# EAGLE design clock-delay (EAGLE 7.6.0)
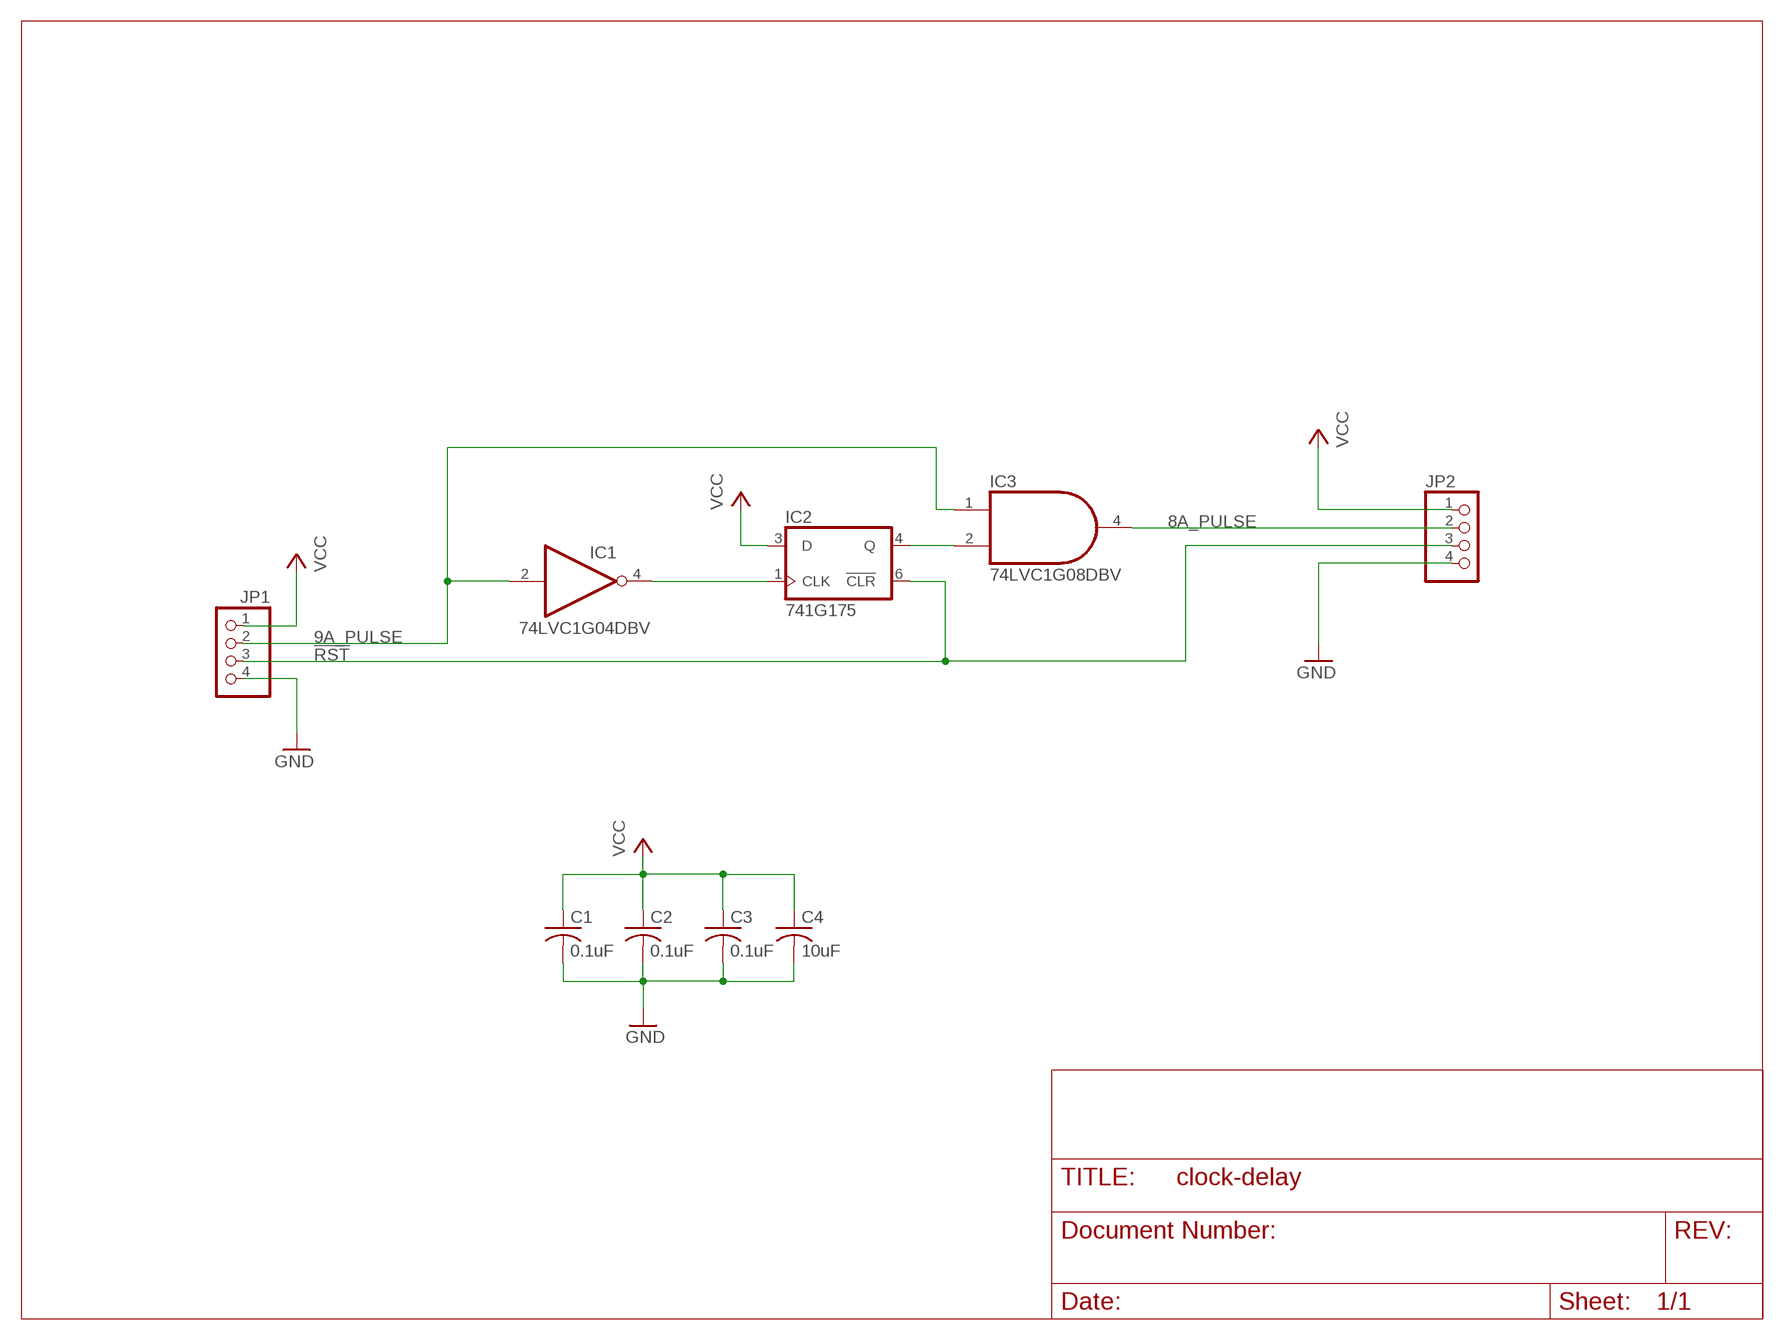
[diagram p0: schematic, sheet 1]

## Parts
C1  0.1uF  C-USC0805  [C0805]
C2  0.1uF  C-USC0805  [C0805]
C3  0.1uF  C-USC0805  [C0805]
C4  10uF  C-USC0805  [C0805]
IC1  74LVC1G04DBV  [SOT23-5]
IC2  741G175  [DBV_R-PDSO-G6]
IC3  74LVC1G08DBV  [SOT23-5]
JP1  PINHD-1X4  [1X04]
JP2  PINHD-1X4  [1X04]

## Nets
8A_PULSE: IC3.4(O) JP2.2
9A_PULSE: IC1.2(I) IC3.1(I0) JP1.2
!RST: IC2.6(!CLR) JP1.3 JP2.3
GND: C1.2 C2.2 C3.2 C4.2 JP1.4 JP2.4
N$12: IC2.4(Q) IC3.2(I1)
N$23: IC1.4(O) IC2.1(CLK)
VCC: C1.1 C2.1 C3.1 C4.1 IC2.3(D) JP1.1 JP2.1

## Power pins joined to a net without a drawn wire
GND: IC1.3(GND) IC2.2(GND) IC3.3(GND)
VCC: IC1.5(VCC) IC2.5(VCC) IC3.5(VCC)

## Library data of the parts
C1-C4 = resistor:C-US: CAPACITOR, American symbol
IC1 = 74xx-little-us:74*1G04: INVERTER Gate
IC2 = witch-e:74*1G175
IC3 = 74xx-little-us:74*1G08: 2-input AND gate
JP1 JP2 = pinhead:PINHD-1X4: PIN HEADER

## Board
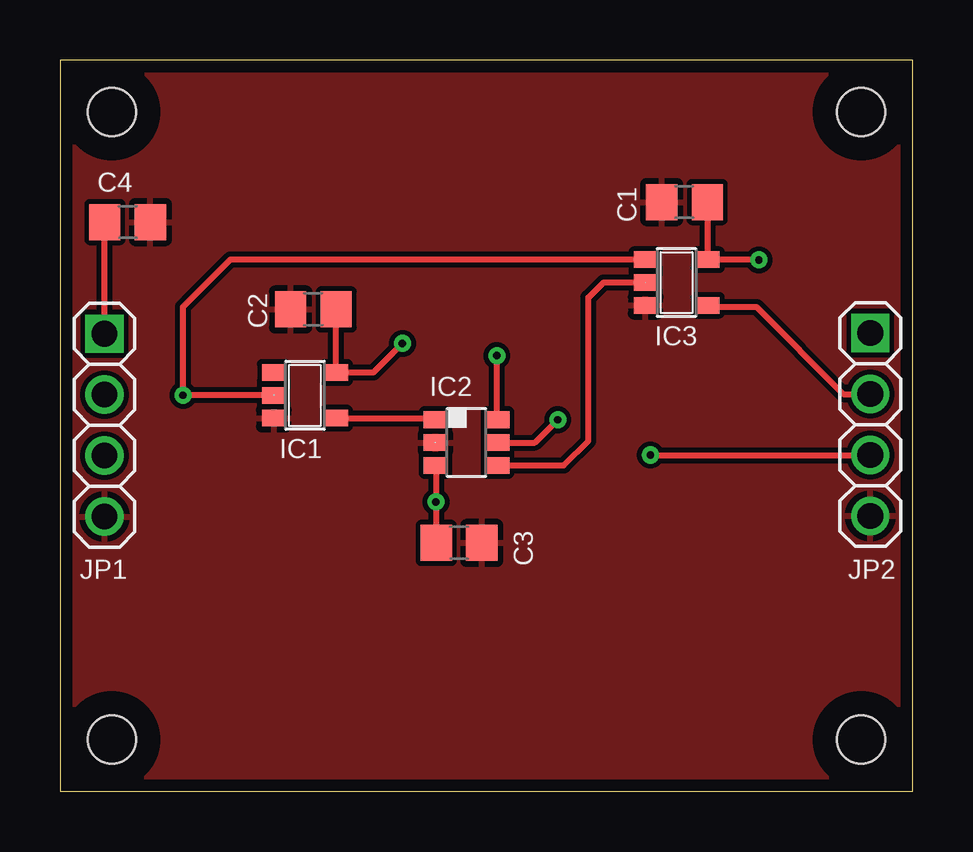
[diagram p1: board, top side]
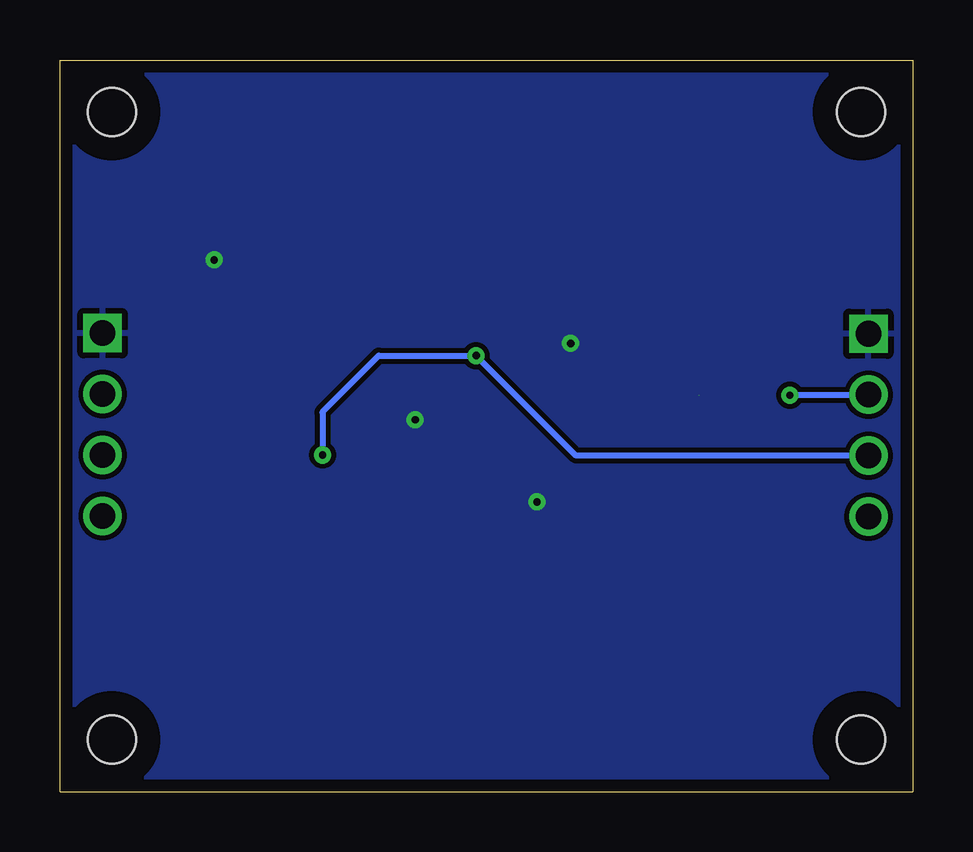
[diagram p2: board, bottom side, seen from below]

Size 35.56 x 30.48 mm. Coordinates in mm from the lower left corner, seen from the top.
Outline: 35.56,30.48 0,30.48 0,0 35.56,0 35.56,30.48
Copper layers (1*16): Top 0.035mm / dielectric 1.5mm / Bottom 0.035mm
Design rules "default *": minimum track width 8mil, minimum drill 12mil, track to track 8mil, track to pad 8mil, pad to pad 8mil, via to via 8mil, smd to smd 8mil, copper to edge 20mil, drill to drill 8mil, minimum pad ring 10mil, minimum via ring 8mil, stop-mask expansion 4mil, vias tented up to drill 0mil, thermal gap 10mil
Holes 2.01 mm at 2.16,2.16 33.4,2.16 33.4,28.32 2.16,28.32
tRestrict: area 31.4,0.2 to 35.4,4.2; area 31.4,26.3 to 35.4,30.3; area 0.2,26.3 to 4.2,30.3; area 0.2,0.2 to 4.2,4.2
bRestrict: area 31.4,0.2 to 35.4,4.2; area 31.4,26.3 to 35.4,30.3; area 0.2,26.3 to 4.2,30.3; area 0.2,0.2 to 4.2,4.2

### Footprints (pad centres in the part's own frame; a part is rotated, then mirrored left to right if it is on the bottom)
C0805 = smd 1.3 x 1.5: 1 -0.95,0; 2 0.95,0
SOT23-5 = smd 0.69 x 0.99: 1 -0.95,-1.29; 2 0,-1.29; 3 0.95,-1.29; 4 0.95,1.3; 5 -0.95,1.3
DBV_R-PDSO-G6 = smd 0.69 x 0.99: 1 -0.95,-1.29; 2 0,-1.29; 3 0.95,-1.29; 4 0.95,1.3; 5 0,1.3; 6 -0.95,1.3
1X04 = drill 1.067 square: 1 -3.81,0 | drill 1.067: 2 -1.27,0; 3 1.27,0; 4 3.81,0

### Placement (x,y rotation side)
C1  26.04,24.56 180 top
C2  10.57,20.09 180 top
C3  16.64,10.36 0 top
C4  2.82,23.72 0 top
IC1  10.21,16.51 270 top
IC2  16.94,14.54 270 top
IC3  25.7,21.21 270 top
JP1  1.85,15.27 270 top
JP2  33.78,15.29 270 top

### Tracks (layer width: path | path; a pad name or v marks a point on that pad's centre or on a via)
8A_PULSE
  Top 0.254: IC3.4 27.07,20.19 29.03,20.19 32.66,16.56 JP2.2
9A_PULSE  (via drill 0.3)  (1 unrouted)
  Top 0.254: 24.43,22.18 IC3.1 7.1,22.16 5.13,20.19 v5.13,16.51 IC1.2
  Bottom 0.254: v5.13,16.51 5.11,16.54 JP1.2
!RST  (via drill 0.3)
  Top 0.254: IC2.6 18.21,15.52 v18.21,18.16 | v24.61,14.02 JP2.3
  Bottom 0.254: JP1.3 14.05,13.99 v18.21,18.16 22.28,18.16 24.59,15.85 arc-45 24.61,15.79 v24.61,14.02
GND
  pour Top: 0,0 35.56,0 35.56,30.48 0,30.48
N$12
  Top 0.254: IC2.4 21.01,13.59 22.02,14.61 22.02,20.57 22.66,21.21 IC3.2
N$23
  Top 0.254: IC1.4 15.58,15.56 IC2.1
VCC  (via drill 0.3)
  Top 0.254: IC2.5 19.8,14.54 v20.75,15.49 | IC1.5 13.07,17.46 v14.28,18.67 | IC2.3 15.67,13.59 v15.67,12.06 15.67,10.38 C3.1 | IC1.5 11.52,17.43 | v29.13,22.15 27.02,22.15 | 27.02,22.15 IC3.5 | IC1.5 C2.1 | 27.02,22.15 27.02,24.53 C1.1 | JP1.1 1.85,23.69 arc-45 C4.1
  pour Bottom: 0,0 35.56,0 35.56,30.48 0,30.48

### Text on the board
Document: CLOCK DELAY MODULE